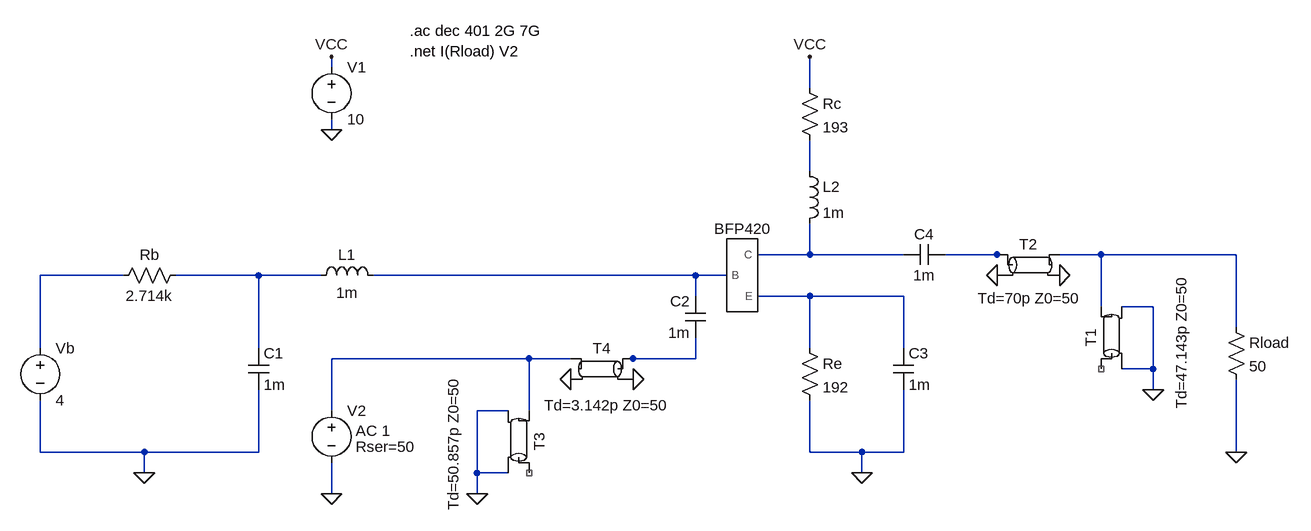
[diagram p0: schematic circuito_adaptacao_distributed.asc]
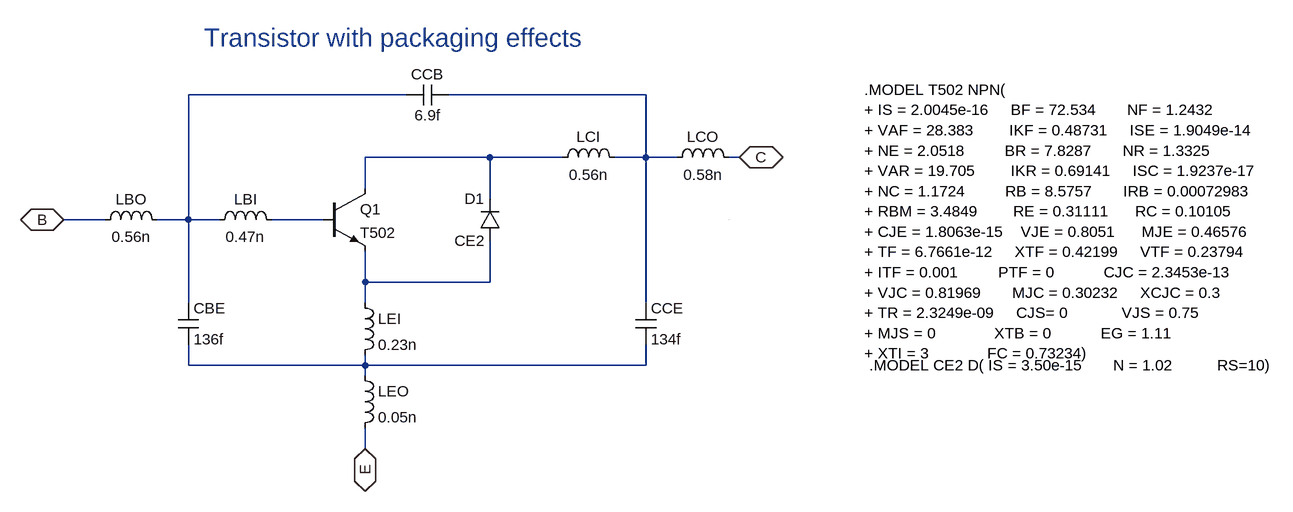
[diagram p1: sub-circuit transistor_encapsulado.asc]
circuito_adaptacao_distributed.asc, the LTspice schematic file:
Version 4
SHEET 1 1732 820
WIRE -208 -240 -208 -256
WIRE 528 -208 528 -256
WIRE -208 -144 -208 -160
WIRE 528 -80 528 -128
WIRE 528 48 528 0
WIRE 528 48 448 48
WIRE 672 48 528 48
WIRE 816 48 736 48
WIRE 832 48 816 48
WIRE 976 48 912 48
WIRE 1184 48 976 48
WIRE -528 80 -656 80
WIRE -320 80 -448 80
WIRE -224 80 -320 80
WIRE 352 80 -144 80
WIRE 400 80 352 80
WIRE 352 112 352 80
WIRE 528 112 448 112
WIRE 672 112 528 112
WIRE 976 128 976 48
WIRE 1056 128 1008 128
WIRE 1184 160 1184 48
WIRE -656 192 -656 80
WIRE -320 192 -320 80
WIRE 528 192 528 112
WIRE 672 192 672 112
WIRE 96 208 -208 208
WIRE 160 208 96 208
WIRE 256 208 240 208
WIRE 352 208 352 176
WIRE 352 208 256 208
WIRE 1056 224 1056 128
WIRE 1056 224 1008 224
WIRE 1056 256 1056 224
WIRE -208 288 -208 208
WIRE 64 288 16 288
WIRE 96 288 96 208
WIRE -656 352 -656 272
WIRE -496 352 -656 352
WIRE -320 352 -320 256
WIRE -320 352 -496 352
WIRE 528 352 528 272
WIRE 608 352 528 352
WIRE 672 352 672 256
WIRE 672 352 608 352
WIRE 1184 352 1184 240
WIRE -496 384 -496 352
WIRE 16 384 16 288
WIRE 64 384 16 384
WIRE 608 384 608 352
WIRE -208 416 -208 368
WIRE 16 416 16 384
FLAG 528 -256 VCC
FLAG 608 384 0
FLAG -208 -144 0
FLAG -208 -256 VCC
FLAG -496 384 0
FLAG 912 80 0
FLAG 816 80 0
FLAG 1056 256 0
FLAG 1184 352 0
FLAG 160 240 0
FLAG 256 240 0
FLAG 16 416 0
FLAG -208 416 0
SYMBOL voltage -656 176 R0
SYMATTR InstName Vb
SYMATTR Value 4
SYMBOL res -432 64 R90
WINDOW 0 0 56 VBottom 2
WINDOW 3 32 56 VTop 2
SYMATTR InstName Rb
SYMATTR Value 2.714k
SYMBOL transistor_encapsulado 416 80 R0
SYMATTR InstName BFP420
SYMBOL res 512 176 R0
SYMATTR InstName Re
SYMATTR Value 192
SYMBOL res 512 -224 R0
SYMATTR InstName Rc
SYMATTR Value 193
SYMBOL voltage -208 -256 R0
SYMATTR InstName V1
SYMATTR Value 10
SYMBOL ind -240 96 R270
WINDOW 0 32 56 VTop 2
WINDOW 3 5 56 VBottom 2
SYMATTR InstName L1
SYMATTR Value 1m
SYMBOL cap -336 192 R0
SYMATTR InstName C1
SYMATTR Value 1m
SYMBOL voltage -208 272 R0
WINDOW 123 37 47 Left 2
WINDOW 39 37 72 Left 2
SYMATTR Value2 AC 1
SYMATTR SpiceLine Rser=50
SYMATTR InstName V2
SYMATTR Value ""
SYMBOL cap 368 176 R180
WINDOW 0 24 56 Left 2
WINDOW 3 24 8 Left 2
SYMATTR InstName C2
SYMATTR Value 1m
SYMBOL cap 656 192 R0
SYMATTR InstName C3
SYMATTR Value 1m
SYMBOL cap 736 32 R90
WINDOW 0 0 32 VBottom 2
WINDOW 3 32 32 VTop 2
SYMATTR InstName C4
SYMATTR Value 1m
SYMBOL res 1168 144 R0
SYMATTR InstName Rload
SYMATTR Value 50
SYMBOL ind 512 -96 R0
SYMATTR InstName L2
SYMATTR Value 1m
SYMBOL tline 992 176 R270
WINDOW 3 -6 92 Top 2
SYMATTR InstName T1
SYMATTR Value Td=47.143p Z0=50
SYMBOL tline 864 64 R0
WINDOW 3 2 36 Top 2
SYMATTR InstName T2
SYMATTR Value Td=70p Z0=50
SYMBOL tline 80 336 M270
WINDOW 3 -2 85 Top 2
SYMATTR InstName T3
SYMATTR Value Td=50.857p Z0=50
SYMBOL tline 208 224 M0
WINDOW 3 -8 40 Top 2
SYMATTR InstName T4
SYMATTR Value Td=3.142p Z0=50
TEXT -88 -296 Left 2 !.ac dec 401 2G 7G\n.net I(Rload) V2

transistor_encapsulado.asc, the sub-circuit schematic file:
Version 4
SHEET 1 2296 772
WIRE 464 -16 128 -16
WIRE 832 -16 528 -16
WIRE 592 80 400 80
WIRE 704 80 592 80
WIRE 832 80 832 -16
WIRE 832 80 784 80
WIRE 880 80 832 80
WIRE 976 80 960 80
WIRE 400 128 400 80
WIRE 592 144 592 80
WIRE 0 176 -64 176
WIRE 128 176 128 -16
WIRE 128 176 80 176
WIRE 176 176 128 176
WIRE 336 176 256 176
WIRE 400 272 400 224
WIRE 592 272 592 208
WIRE 592 272 400 272
WIRE 128 304 128 176
WIRE 400 304 400 272
WIRE 832 304 832 80
WIRE 128 400 128 368
WIRE 400 400 400 384
WIRE 400 400 128 400
WIRE 832 400 832 368
WIRE 832 400 400 400
WIRE 400 416 400 400
WIRE 400 528 400 496
FLAG -64 176 B
IOPIN -64 176 BiDir
FLAG 976 80 C
IOPIN 976 80 BiDir
FLAG 400 528 E
IOPIN 400 528 BiDir
SYMBOL npn 336 128 R0
SYMATTR InstName Q1
SYMATTR Value T502
SYMBOL diode 608 208 R180
WINDOW 0 24 64 Left 2
WINDOW 3 24 0 Left 2
SYMATTR InstName D1
SYMATTR Value CE2
SYMBOL ind 688 96 R270
WINDOW 0 32 56 VTop 2
WINDOW 3 5 56 VBottom 2
SYMATTR InstName LCI
SYMATTR Value 0.56n
SYMBOL ind 864 96 R270
WINDOW 0 32 56 VTop 2
WINDOW 3 5 56 VBottom 2
SYMATTR InstName LCO
SYMATTR Value 0.58n
SYMBOL ind 160 192 R270
WINDOW 0 32 56 VTop 2
WINDOW 3 5 56 VBottom 2
SYMATTR InstName LBI
SYMATTR Value 0.47n
SYMBOL ind -16 192 R270
WINDOW 0 32 56 VTop 2
WINDOW 3 5 56 VBottom 2
SYMATTR InstName LBO
SYMATTR Value 0.56n
SYMBOL ind 384 288 R0
SYMATTR InstName LEI
SYMATTR Value 0.23n
SYMBOL ind 384 400 R0
SYMATTR InstName LEO
SYMATTR Value 0.05n
SYMBOL cap 112 304 R0
SYMATTR InstName CBE
SYMATTR Value 136f
SYMBOL cap 816 304 R0
SYMATTR InstName CCE
SYMATTR Value 134f
SYMBOL cap 464 0 R270
WINDOW 0 32 32 VTop 2
WINDOW 3 0 32 VBottom 2
SYMATTR InstName CCB
SYMATTR Value 6.9f
TEXT 1168 -24 Left 2 !.MODEL T502 NPN(\n+ IS = 2.0045e-16     BF = 72.534       NF = 1.2432\n+ VAF = 28.383        IKF = 0.48731     ISE = 1.9049e-14\n+ NE = 2.0518         BR = 7.8287       NR = 1.3325\n+ VAR = 19.705        IKR = 0.69141     ISC = 1.9237e-17\n+ NC = 1.1724         RB = 8.5757       IRB = 0.00072983\n+ RBM = 3.4849        RE = 0.31111      RC = 0.10105\n+ CJE = 1.8063e-15    VJE = 0.8051      MJE = 0.46576\n+ TF = 6.7661e-12     XTF = 0.42199     VTF = 0.23794\n+ ITF = 0.001         PTF = 0           CJC = 2.3453e-13\n+ VJC = 0.81969       MJC = 0.30232     XCJC = 0.3\n+ TR = 2.3249e-09     CJS= 0            VJS = 0.75\n+ MJS = 0             XTB = 0           EG = 1.11\n+ XTI = 3             FC = 0.73234)
TEXT 1176 400 Left 2 !.MODEL CE2 D( IS = 3.50e-15       N = 1.02          RS=10)
TEXT 152 -104 Left 4 ;Transistor with packaging effects
RECTANGLE Normal 960 176 960 176 2

The netlist it stands for:
* circuito_adaptacao_distributed.asc
Vb N005 0 4
Rb N006 N005 2.714k
XBFP420 N007 N002 N008 transistor_encapsulado
Re N008 0 192
Rc VCC N001 193
V1 VCC 0 10
L1 N006 N007 1m
C1 N006 0 1m
V2 N009 0 AC 1 Rser=50
C2 N010 N007 1m
C3 N008 0 1m
C4 N003 N002 1m
Rload N004 0 50
L2 N001 N002 1m
T1 NC_01 0 N004 0 Td=47.143p Z0=50
T2 N003 0 N004 0 Td=70p Z0=50
T3 NC_02 0 N009 0 Td=50.857p Z0=50
T4 N010 0 N009 0 Td=3.142p Z0=50

* block symbol definitions
.subckt transistor_encapsulado B C E
Q1 N003 N004 N005 0 T502
D1 N005 N003 CE2
LCI N003 N002 0.56n
LCO N002 C 0.58n
LBI N001 N004 0.47n
LBO B N001 0.56n
LEI N005 N006 0.23n
LEO N006 E 0.05n
CBE N001 N006 136f
CCE N002 N006 134f
CCB N001 N002 6.9f
.MODEL T502 NPN(
+ IS = 2.0045e-16     BF = 72.534       NF = 1.2432
+ VAF = 28.383        IKF = 0.48731     ISE = 1.9049e-14
+ NE = 2.0518         BR = 7.8287       NR = 1.3325
+ VAR = 19.705        IKR = 0.69141     ISC = 1.9237e-17
+ NC = 1.1724         RB = 8.5757       IRB = 0.00072983
+ RBM = 3.4849        RE = 0.31111      RC = 0.10105
+ CJE = 1.8063e-15    VJE = 0.8051      MJE = 0.46576
+ TF = 6.7661e-12     XTF = 0.42199     VTF = 0.23794
+ ITF = 0.001         PTF = 0           CJC = 2.3453e-13
+ VJC = 0.81969       MJC = 0.30232     XCJC = 0.3
+ TR = 2.3249e-09     CJS= 0            VJS = 0.75
+ MJS = 0             XTB = 0           EG = 1.11
+ XTI = 3             FC = 0.73234)
.MODEL CE2 D( IS = 3.50e-15       N = 1.02          RS=10)
* Transistor with packaging effects
.ends transistor_encapsulado

.model D D
.lib standard.dio
.model NPN NPN
.model PNP PNP
.lib standard.bjt
.ac dec 401 2G 7G
.net I(Rload) V2
.backanno
.end